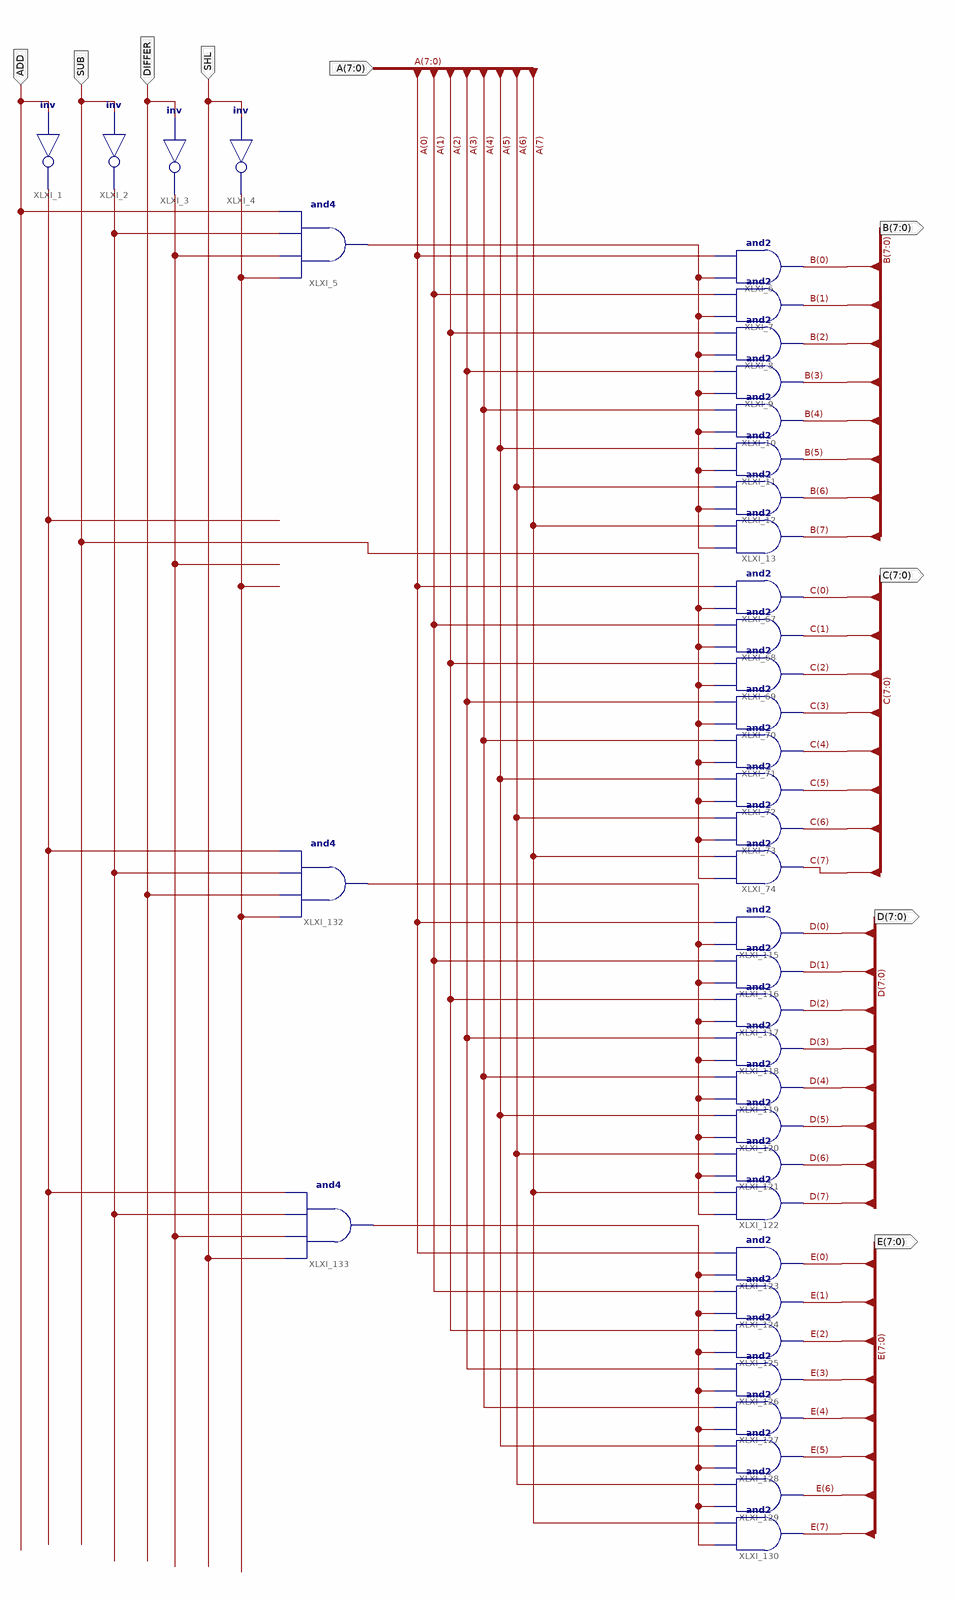
[diagram p0: schematic sheet 1]
// Xilinx ISE schematic DEMUX4to1.sch (spartan6) as structural Verilog: 39 symbols, 9 ports
module DEMUX4to1 (
  input  SHL,
  input  DIFFER,
  input  SUB,
  input  ADD,
  input  [7:0] A,
  output [7:0] B,
  output [7:0] C,
  output [7:0] D,
  output [7:0] E
);

  wire XLXN_156, XLXN_157, XLXN_159, XLXN_160, XLXN_193, XLXN_197, XLXN_199;

  not XLXI_1 (XLXN_156, ADD);
  not XLXI_2 (XLXN_157, SUB);
  not XLXI_3 (XLXN_159, DIFFER);
  not XLXI_4 (XLXN_160, SHL);
  and XLXI_5 (XLXN_193, XLXN_160, XLXN_159, XLXN_157, ADD);
  and XLXI_6 (B[0], XLXN_193, A[0]);
  and XLXI_7 (B[1], XLXN_193, A[1]);
  and XLXI_8 (B[2], XLXN_193, A[2]);
  and XLXI_9 (B[3], XLXN_193, A[3]);
  and XLXI_10 (B[4], XLXN_193, A[4]);
  and XLXI_11 (B[5], XLXN_193, A[5]);
  and XLXI_12 (B[6], XLXN_193, A[6]);
  and XLXI_13 (B[7], XLXN_193, A[7]);
  and XLXI_67 (C[0], SUB, A[0]);
  and XLXI_68 (C[1], SUB, A[1]);
  and XLXI_69 (C[2], SUB, A[2]);
  and XLXI_70 (C[3], SUB, A[3]);
  and XLXI_71 (C[4], SUB, A[4]);
  and XLXI_72 (C[5], SUB, A[5]);
  and XLXI_73 (C[6], SUB, A[6]);
  and XLXI_74 (C[7], SUB, A[7]);
  and XLXI_115 (D[0], XLXN_197, A[0]);
  and XLXI_116 (D[1], XLXN_197, A[1]);
  and XLXI_117 (D[2], XLXN_197, A[2]);
  and XLXI_118 (D[3], XLXN_197, A[3]);
  and XLXI_119 (D[4], XLXN_197, A[4]);
  and XLXI_120 (D[5], XLXN_197, A[5]);
  and XLXI_121 (D[6], XLXN_197, A[6]);
  and XLXI_122 (D[7], XLXN_197, A[7]);
  and XLXI_123 (E[0], XLXN_199, A[0]);
  and XLXI_124 (E[1], XLXN_199, A[1]);
  and XLXI_125 (E[2], XLXN_199, A[2]);
  and XLXI_126 (E[3], XLXN_199, A[3]);
  and XLXI_127 (E[4], XLXN_199, A[4]);
  and XLXI_128 (E[5], XLXN_199, A[5]);
  and XLXI_129 (E[6], XLXN_199, A[6]);
  and XLXI_130 (E[7], XLXN_199, A[7]);
  and XLXI_132 (XLXN_197, XLXN_160, DIFFER, XLXN_157, XLXN_156);
  and XLXI_133 (XLXN_199, SHL, XLXN_159, XLXN_157, XLXN_156);
endmodule
